# EAGLE schematic actpcb (EAGLE 4.11)
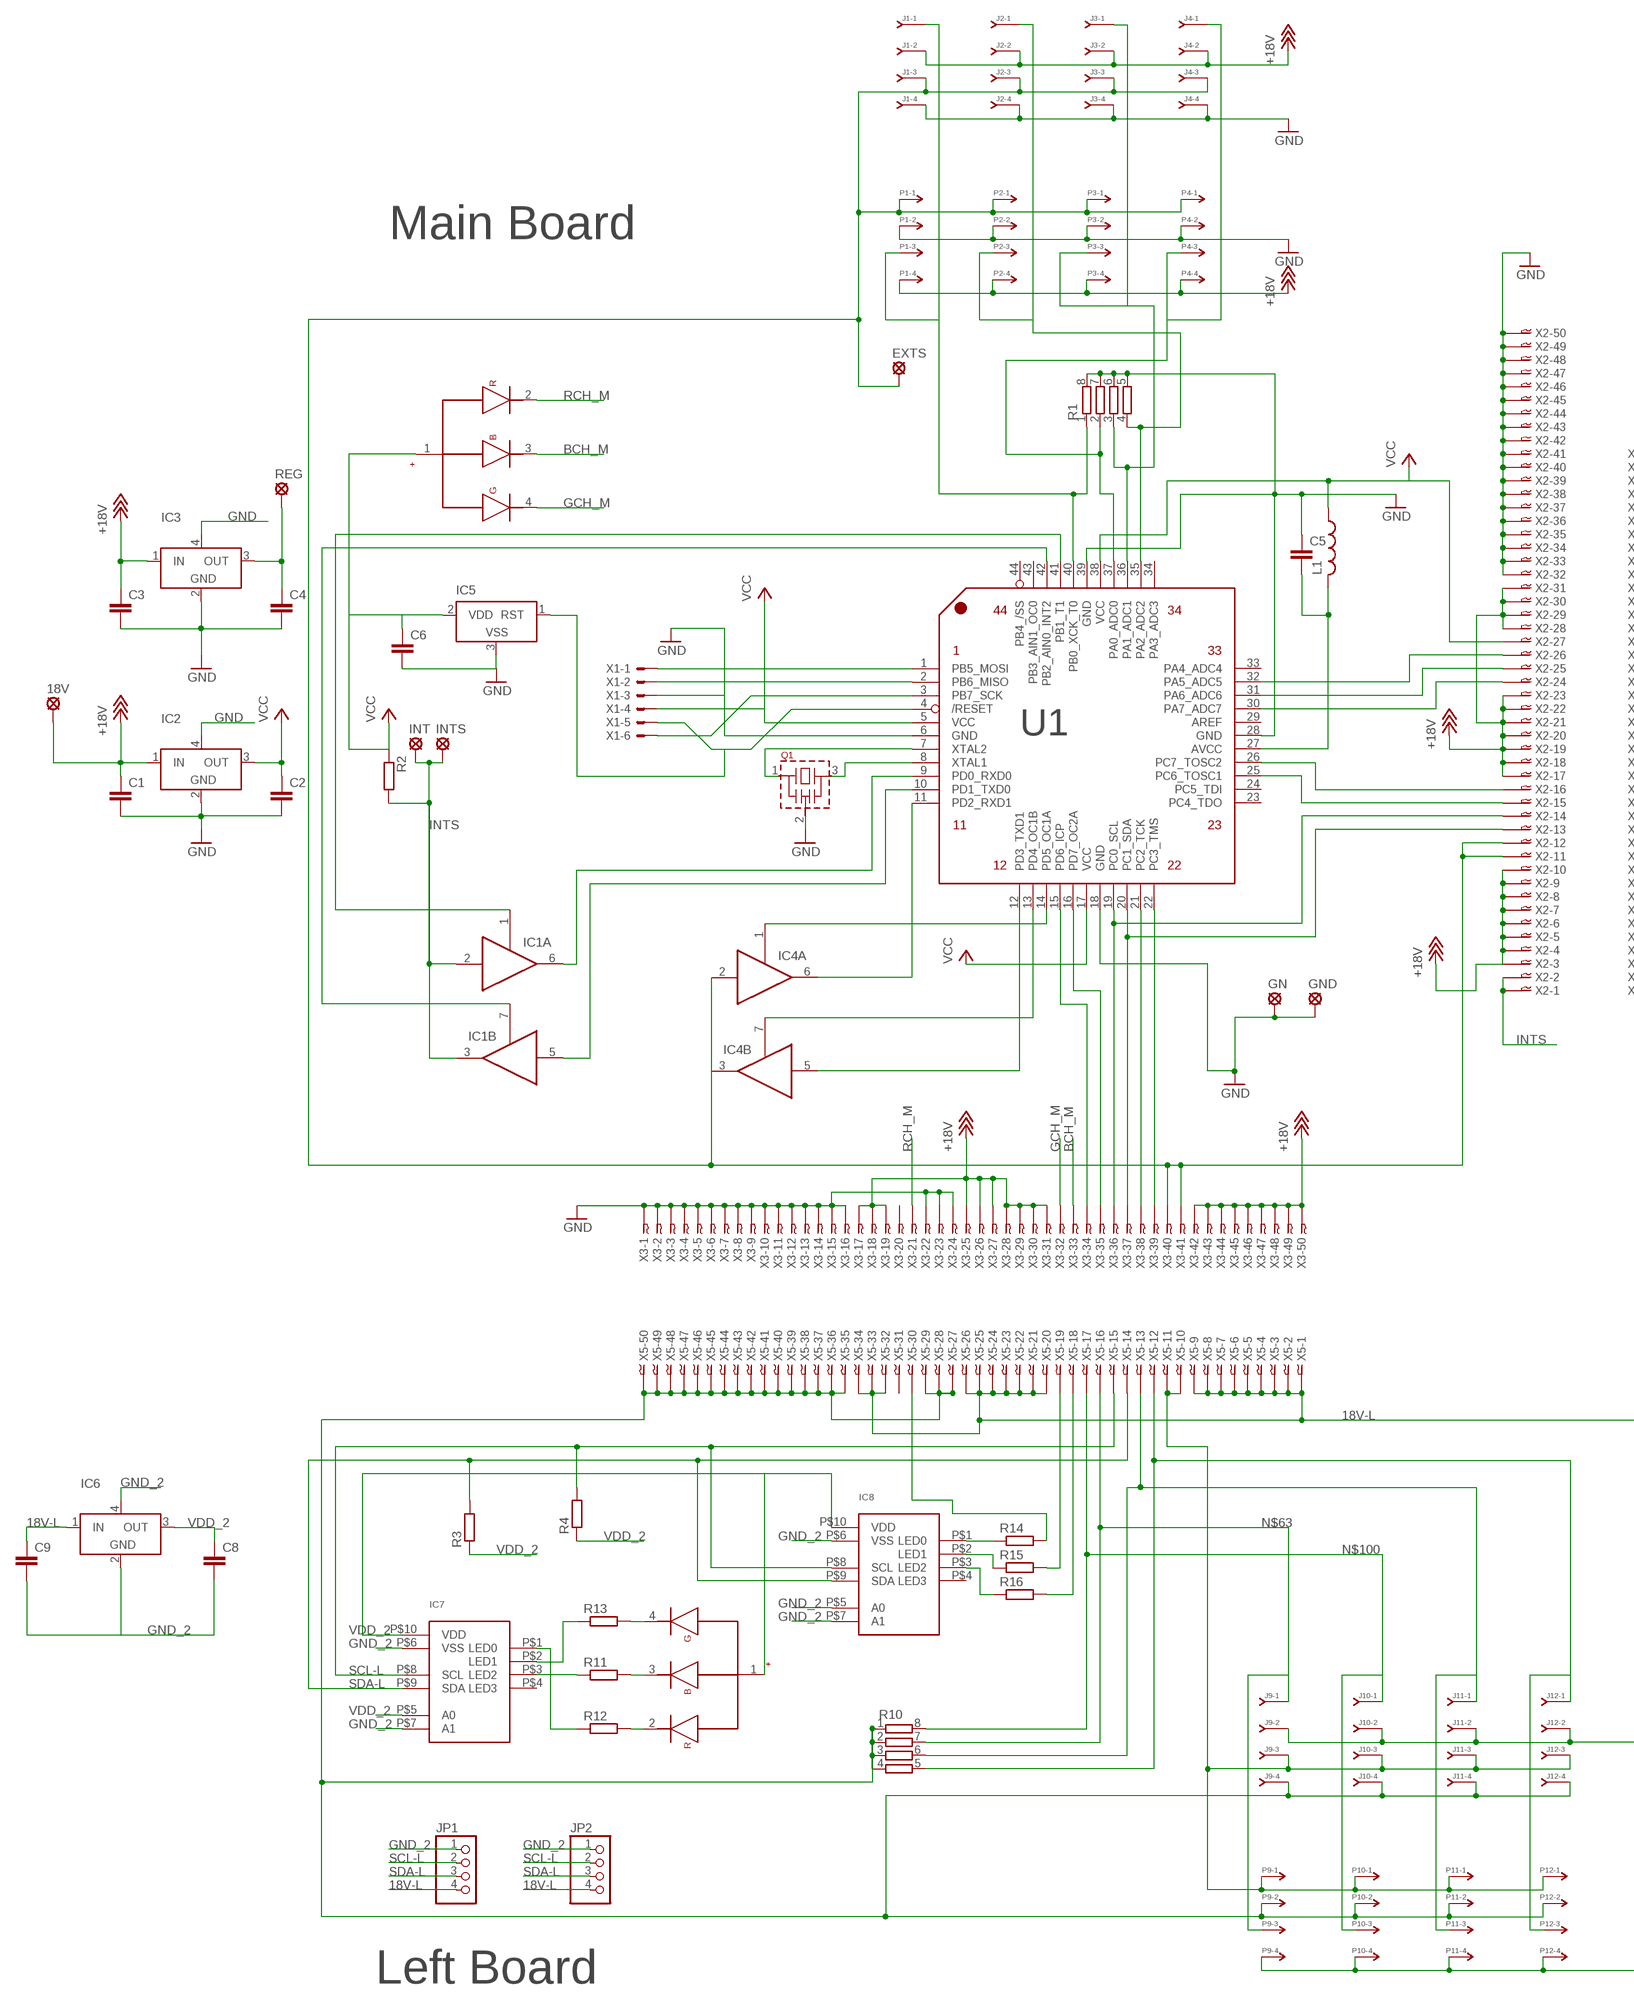
[diagram p0: schematic, sheet 1, part 1 of 2]
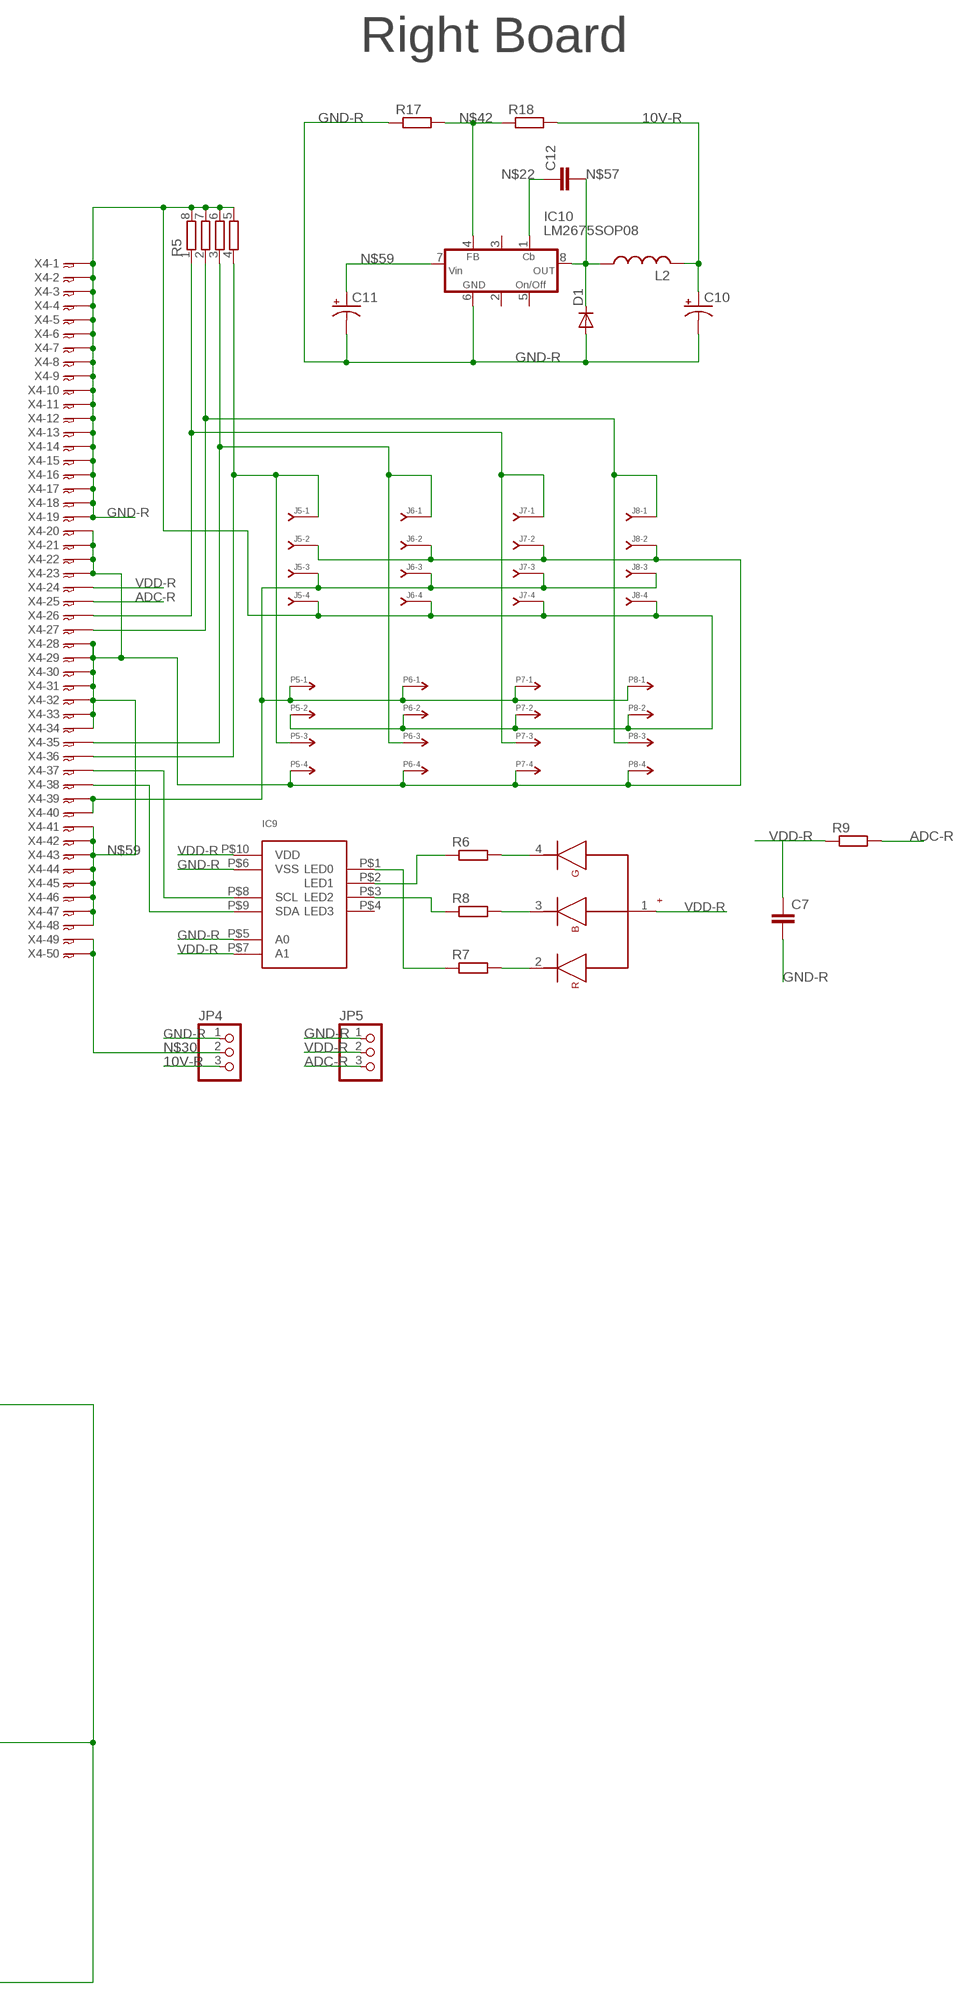
[diagram p1: schematic, sheet 1, part 2 of 2]

## Parts
18V  MCS10B  [MCS10B]
C1  C-EUC0603  [C0603]
C2  C-EUC1206  [C1206]
C3  C-EUC0603  [C0603]
C4  C-EUC1206  [C1206]
C5  C-EUC0603K  [C0603K]
C6  C-EUC0603K  [C0603K]
C7  C-EUC0603  [C0603]
C8  C-EUC1206  [C1206]
C9  C-EUC0603  [C0603]
C10  CPOL-USD/7343-31R  [D/7343-31R]
C11  CPOL-USD/7343-31R  [D/7343-31R]
C12  C-EUC0603K  [C0603K]
D1  ES2DSMA  [SMA]
EXTS  1W  MCS10B  [MCS10B]
GN  MCS10B  [MCS10B]
GND  MCS10B  [MCS10B]
IC1  74LS126X2D  [VSSOP-8]
IC2  LT1129CST5  [SOT223]
IC3  LT1129CST5  [SOT223]
IC4  74LS126X2D  [VSSOP-8]
IC5  MCP120  [SOT23C]
IC6  LT1129CST5  [SOT223]
IC7  PCA9633  [TSSOP10]
IC8  PCA9633  [TSSOP10]
IC9  PCA9633  [TSSOP10]
IC10  LM2675SOP08  [SOP-08]
INT  MCS10B  [MCS10B]
INTS  MCS10B  [MCS10B]
J1  J-04-  [79109-04]
J2  J-04-  [79109-04]
J3  J-04-  [79109-04]
J4  J-04-  [79109-04]
J5  J-04-  [79109-04]
J6  J-04-  [79109-04]
J7  J-04-  [79109-04]
J8  J-04-  [79109-04]
J9  J-04-  [79109-04]
J10  J-04-  [79109-04]
J11  J-04-  [79109-04]
J12  J-04-  [79109-04]
JP1  PINHD-1X4ROUND  [1X04R]
JP2  PINHD-1X4ROUND  [1X04R]
JP4  PINHD-1X3ROUND  [1X03R]
JP5  PINHD-1X3ROUND  [1X03R]
L1  L-USL2012C  [L2012C]
L2  L-US  [DR1050]
LED1  OVSTRGBAC6VER2  [OVSTRGBAC6V2]
LED2  OVSTRGBAC6VER2  [OVSTRGBAC6V2]
LED3  OVSTRGBAC6VER2  [OVSTRGBAC6V2]
P1  P-04-  [79109-041]
P2  P-04-  [79109-041]
P3  P-04-  [79109-041]
P4  P-04-  [79109-041]
P5  P-04-  [79109-041]
P6  P-04-  [79109-041]
P7  P-04-  [79109-041]
P8  P-04-  [79109-041]
P9  P-04-  [79109-041]
P10  P-04-  [79109-041]
P11  P-04-  [79109-041]
P12  P-04-  [79109-041]
Q1  CSTCE  [CSTCE]
R1  0402X4  [0402X4]
R2  R-EU_R0603  [R0603]
R3  R-EU_R0603  [R0603]
R4  R-EU_R0603  [R0603]
R5  0402X4  [0402X4]
R6  R-EU_R0603  [R0603]
R7  R-EU_R0603  [R0603]
R8  R-EU_R0603  [R0603]
R9  R-EU_R0603  [R0603]
R10  0402X4  [0402X4]
R11  R-EU_R0603  [R0603]
R12  R-EU_R0603  [R0603]
R13  R-EU_R0603  [R0603]
R14  R-EU_R0603  [R0603]
R15  R-EU_R0603  [R0603]
R16  R-EU_R0603  [R0603]
R17  R-EU_R0603  [R0603]
R18  R-EU_R0603  [R0603]
REG  MCS10B  [MCS10B]
U1  ATMEGA164-16AI  [MLF44]
X1  53-06  [53047-06V1]
X2  05A02-50  [05A02-50SM]
X3  05A02-50  [05A02-50SM]
X4  05A02-50  [05A02-50SM]
X5  05A02-50  [05A02-50SM]

## Nets
10V-R: C10.+ JP4.3 L2.2 R18.2
18V-L: C9.1 IC6.1(IN) J9.2 J10.2 J11.2 J12.2 JP1.4 JP2.4 P9.4 P10.4 P11.4 P12.4 X5.1 X5.2 X5.3 X5.4 X5.5 X5.6 X5.7 X5.8 X5.9 X5.20 X5.21 X5.22 X5.23 X5.24 X5.25 X5.26 X5.32 X5.33 X5.34
+18V: 18V.MP C1.1 C3.1 IC2.1(IN) IC3.1(IN) J1.2 J2.2 J3.2 J4.2 P1.4 P2.4 P3.4 P4.4 X2.3 X2.4 X2.5 X2.6 X2.7 X2.8 X2.9 X2.10 X2.17 X2.18 X2.19 X2.20 X2.21 X2.22 X2.23 X2.28 X2.29 X2.30 X2.31 X3.17 X3.18 X3.19 X3.25 X3.26 X3.27 X3.28 X3.29 X3.30 X3.31 X3.42 X3.43 X3.44 X3.45 X3.46 X3.47 X3.48 X3.49 X3.50
ADC-R: JP5.3 R9.2 X4.25
BCH_M: LED1.3(BLUECATH) X3.33
GCH_M: LED1.4(GRCATH) X3.32
GND: C1.2 C2.2 C3.2 C4.2 C5.1 C6.2 GN.MP GND.MP IC2.2(GND) IC2.4(GND1) IC3.2(GND) IC3.4(GND1) IC5.3(GND) J1.4 J2.4 J3.4 J4.4 P1.2 P2.2 P3.2 P4.2 Q1.2(VSS) R1.5 R1.6 R1.7 R1.8 U1.6(GND) U1.18(GND) U1.28(GND) U1.39(GND) X1.3 X2.32 X2.33 X2.34 X2.35 X2.36 X2.37 X2.38 X2.39 X2.40 X2.41 X2.42 X2.43 X2.44 X2.45 X2.46 X2.47 X2.48 X2.49 X2.50 X3.1 X3.2 X3.3 X3.4 X3.5 X3.6 X3.7 X3.8 X3.9 X3.10 X3.11 X3.12 X3.13 X3.14 X3.15 X3.16 X3.22 X3.23 X3.24
GND-R: C7.2 C10.- C11.- D1.A IC9.P$5(A0) IC9.P$6(VSS) IC10.6(GND) J5.4 J6.4 J7.4 J8.4 JP4.1 JP5.1 P5.2 P6.2 P7.2 P8.2 R5.5 R5.6 R5.7 R5.8 R17.1 X4.1 X4.2 X4.3 X4.4 X4.5 X4.6 X4.7 X4.8 X4.9 X4.10 X4.11 X4.12 X4.13 X4.14 X4.15 X4.16 X4.17 X4.18 X4.19
GND_2: C8.2 C9.2 IC6.2(GND) IC6.4(GND1) IC7.P$6(VSS) IC7.P$7(A1) IC8.P$5(A0) IC8.P$6(VSS) IC8.P$7(A1) J9.4 J10.4 J11.4 J12.4 JP1.1 JP2.1 P9.2 P10.2 P11.2 P12.2 R10.1 R10.2 R10.3 R10.4 X5.27 X5.28 X5.29 X5.35 X5.36 X5.37 X5.38 X5.39 X5.40 X5.41 X5.42 X5.43 X5.44 X5.45 X5.46 X5.47 X5.48 X5.49 X5.50
INTS: IC1.2(A:I) IC1.3(B:O) INT.MP INTS.MP R2.2 X2.1 X2.2
N$1: Q1.1 U1.7(XTAL2)
N$2: Q1.3 U1.8(XTAL1)
N$3: IC1.6(A:O) U1.9(PD0_RXD0)
N$4: IC1.5(B:I) U1.10(PD1_TXD0)
N$6: IC4.6(A:O) U1.11(PD2_RXD1)
N$7: IC4.5(B:I) U1.12(PD3_TXD1)
N$8: IC7.P$1(LED0) R12.1
N$9: IC4.1(A:OE) U1.14(PD5_OC1A)
N$10: U1.20(PC1_SDA) X2.13 X3.37
N$11: IC4.7(B:OE) U1.13(PD4_OC1B)
N$12: U1.22(PC3_TMS) X3.39
N$13: U1.21(PC2_TCK) X3.38
N$14: U1.2(PB6_MISO) X1.2
N$15: U1.1(PB5_MOSI) X1.1
N$16: U1.16(PD7_OC2A) X3.35
N$17: U1.15(PD6_ICP) X3.34
N$18: U1.19(PC0_SCL) X2.14 X3.36
N$19: LED2.2(REDCATH) R12.2
N$20: IC9.P$8(SCL) X4.37
N$21: IC9.P$9(SDA) X4.38
N$22: C12.1 IC10.1(CB)
N$23: IC7.P$2(LED1) R13.1
N$24: J2.1 P2.3 R1.4 U1.35(PA2_ADC2)
N$25: IC7.P$3(LED2) R11.1
N$26: J1.1 P1.3 R1.1 U1.40(PB0_XCK_T0)
N$27: U1.30(PA7_ADC7) X2.24
N$28: U1.31(PA6_ADC6) X2.25
N$29: U1.32(PA5_ADC5) X2.26
N$30: JP4.2 X4.49 X4.50
N$31: U1.25(PC6_TOSC1) X2.15
N$32: U1.3(PB7_SCK) X1.6
N$33: J3.1 P3.3 R1.3 U1.36(PA1_ADC1)
N$34: U1.26(PC7_TOSC2) X2.16
N$35: IC9.P$1(LED0) R7.1
N$36: EXTS.MP IC4.2(A:I) IC4.3(B:O) J1.3 J2.3 J3.3 J4.3 P1.1 P2.1 P3.1 P4.1 X2.11 X2.12 X3.40 X3.41
N$37: IC5.1(RST) U1.4(/RESET) X1.5
N$38: IC1.7(B:OE) U1.42(PB2_AIN0_INT2)
N$39: LED3.2(REDCATH) R7.2
N$40: J4.1 P4.3 R1.2 U1.37(PA0_ADC0)
N$41: IC1.1(A:OE) U1.41(PB1_T1)
N$42: IC10.4(FB) R17.2 R18.1
N$43: IC9.P$2(LED1) R6.1
N$44: LED3.4(GRCATH) R6.2
N$45: J7.1 P7.3 R5.1 X4.26
N$46: J5.3 J6.3 J7.3 J8.3 P5.1 P6.1 P7.1 P8.1 X4.39 X4.40
N$47: IC9.P$3(LED2) R8.1
N$48: J8.1 P8.3 R5.2 X4.27
N$49: LED2.3(BLUECATH) R11.2
N$50: J6.1 P6.3 R5.3 X4.35
N$51: LED2.4(GRCATH) R13.2
N$52: J5.1 P5.3 R5.4 X4.36
N$54: J9.3 J10.3 J11.3 J12.3 P9.1 P10.1 P11.1 P12.1 X5.10 X5.11
N$56: LED3.3(BLUECATH) R8.2
N$57: C12.2 D1.C IC10.8(OUT) L2.1
N$58: IC8.P$1(LED0) R14.1
N$59: C11.+ IC10.7(VIN) J5.2 J6.2 J7.2 J8.2 P5.4 P6.4 P7.4 P8.4 X4.20 X4.21 X4.22 X4.23 X4.28 X4.29 X4.30 X4.31 X4.32 X4.33 X4.34 X4.41 X4.42 X4.43 X4.44 X4.45 X4.46 X4.47 X4.48
N$60: IC8.P$2(LED1) R15.1
N$61: IC8.P$3(LED2) R16.1
N$62: R14.2 X5.30
N$63: J9.1 P9.3 R10.7 X5.16
N$64: J11.1 P11.3 R10.6 X5.13
N$65: R15.2 X5.19
N$66: J12.1 P12.3 R10.5 X5.12
N$67: R16.2 X5.18
N$68: C4.1 IC3.3(OUT) REG.MP
N$69: C2.1 C6.1 IC2.3(OUT) IC5.2(VDD) L1.1 LED1.1(ANODE) R2.1 U1.5(VCC) U1.17(VCC) U1.38(VCC) X1.4 X2.27 ; supply symbol labelled VCC
N$75: C5.2 L1.2 U1.27(AVCC)
N$100: J10.1 P10.3 R10.8 X5.17
RCH_M: LED1.2(REDCATH) X3.21
SCL-L: IC7.P$8(SCL) IC8.P$8(SCL) JP1.2 JP2.2 R4.2 X5.15
SDA-L: IC7.P$9(SDA) IC8.P$9(SDA) JP1.3 JP2.3 R3.2 X5.14
VDD-R: C7.1 IC9.P$7(A1) IC9.P$10(VDD) JP5.2 LED3.1(ANODE) R9.1 X4.24
VDD_2: C8.1 IC6.3(OUT) IC7.P$5(A0) IC7.P$10(VDD) IC8.P$10(VDD) LED2.1(ANODE) R3.1 R4.1
Unconnected: IC7.P$4(LED3) IC8.P$4(LED3) IC9.P$4(LED3) IC10.2 IC10.3 IC10.5(ON/OFF) U1.23(PC4_TDO) U1.24(PC5_TDI) U1.29(AREF) U1.33(PA4_ADC4) U1.34(PA3_ADC3) U1.43(PB3_AIN1_OC0) U1.44(PB4_/SS) X3.20 X5.31

## Notes on the sheet
- Right Board
- Main Board
- Left Board

## Power pins joined to a net without a drawn wire
GND: IC1.4(P:GND) IC4.4(P:GND)
VCC: IC1.8(P:VCC) IC4.8(P:VCC)

## Library data of the parts
18V EXTS GN GND INT INTS REG = solpad:MCS10B: SOLDER PAD MC S1, distributor Buerklin, 15F505
C1-C9 C12 = rcl:C-EU: CAPACITOR, European symbol
C10 C11 = rcl:CPOL-US: POLARIZED CAPACITOR, American symbol
D1 = diode:ES2D: DIODE super fast rectifier, 2 A
IC1 IC4 = 74xx-us:74*126X2: Dual bus BUFFER, 3-state
IC2 IC3 IC6 = linear-technology:LT1129CST5: VOLTAGE REGULATOR with shutdown
IC5 = linear-technology-2:MCP120
IC7-IC9 = rgb_led:PCA9633
IC10 = v-reg:LM2675
J1-J12 = con-headers-jp:J-04-: HEADER JACK PINS
JP1 JP2 = pinhead:PINHD-1X4: PIN HEADER
JP4 JP5 = pinhead:PINHD-1X3: PIN HEADER
L1 L2 = rcl:L-US: INDUCTOR, American symbol
LED1-LED3 = rgb_led:OVSTRGBAC6
P1-P12 = con-headers-jp:P-04-: HEADER PLUG PINS
Q1 = murata-resonators:CSTCE: Ceramic resonator 12.51 to 20.00 MHz
R1 R5 R10 = resistor-bourns:0402X4
R2-R4 R6-R9 R11-R18 = rcl:R-EU_: RESISTOR, European symbol
U1 = atmel:ATMEGA164: 8-bit AVR Microcontroller with 16K Bytes In-System Programmable Flash
X1 = con-molex:53?-06: CONNECTOR wire to board 1.25 mm (.049 inch) pitch header
X2-X5 = con-jst:05A02-50: Molex 50 pin FFC/FPC CONNECTOR